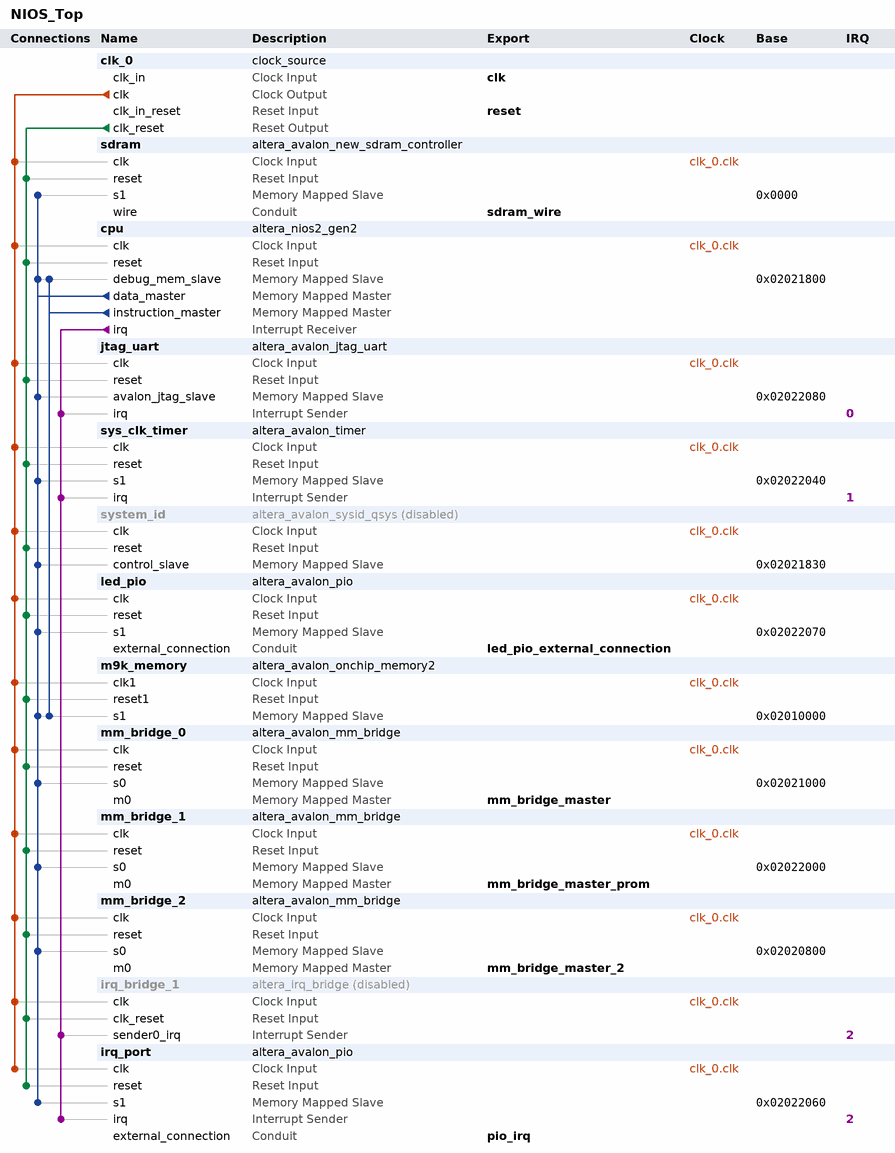
[diagram p0: system contents]
# Platform Designer (Qsys) system NIOS_Top, Cyclone IV E EP4CE22F17C6
# Parameters at their usual value, and those the tool derives, are not listed.
package require -exact qsys 15.0
create_system NIOS_Top
set_project_property DEVICE_FAMILY {Cyclone IV E}
set_project_property DEVICE EP4CE22F17C6

add_instance clk_0 clock_source 15.0
set_instance_parameter_value clk_0 clockFrequency 50000000

add_instance sdram altera_avalon_new_sdram_controller 15.0
set_instance_parameter_value sdram TAC 6.5
set_instance_parameter_value sdram TRCD 20.0
set_instance_parameter_value sdram TRP 20.0
set_instance_parameter_value sdram casLatency 2
set_instance_parameter_value sdram columnWidth 9
set_instance_parameter_value sdram dataWidth 16
set_instance_parameter_value sdram generateSimulationModel false
set_instance_parameter_value sdram initRefreshCommands 8
set_instance_parameter_value sdram model single_Micron_MT48LC4M32B2_7_chip
set_instance_parameter_value sdram numberOfBanks 4
set_instance_parameter_value sdram numberOfChipSelects 1
set_instance_parameter_value sdram powerUpDelay 200.0
set_instance_parameter_value sdram refreshPeriod 0.75
set_instance_parameter_value sdram rowWidth 13

add_instance cpu altera_nios2_gen2 15.0
set_instance_parameter_value cpu dcache_size 0
set_instance_parameter_value cpu exceptionSlave m9k_memory.s1
set_instance_parameter_value cpu icache_size 2048
set_instance_parameter_value cpu impl Tiny
set_instance_parameter_value cpu resetSlave m9k_memory.s1
set_instance_parameter_value cpu setting_branchpredictiontype Static

add_instance jtag_uart altera_avalon_jtag_uart 15.0
set_instance_parameter_value jtag_uart simInteractiveOptions NO_INTERACTIVE_WINDOWS

add_instance sys_clk_timer altera_avalon_timer 15.0
set_instance_parameter_value sys_clk_timer period 1
set_instance_parameter_value sys_clk_timer periodUnits MSEC

add_instance system_id altera_avalon_sysid_qsys 15.0
set_instance_property system_id ENABLED false
set_instance_parameter_value system_id id 2058710259

add_instance led_pio altera_avalon_pio 15.0
set_instance_parameter_value led_pio direction Output
set_instance_parameter_value led_pio width 8

add_instance m9k_memory altera_avalon_onchip_memory2 15.0
set_instance_parameter_value m9k_memory dataWidth 32
set_instance_parameter_value m9k_memory dualPort false
set_instance_parameter_value m9k_memory initMemContent true
set_instance_parameter_value m9k_memory initializationFileName onchip_mem.hex
set_instance_parameter_value m9k_memory memorySize 40000

add_instance mm_bridge_0 altera_avalon_mm_bridge 15.0
set_instance_parameter_value mm_bridge_0 ADDRESS_UNITS WORDS
set_instance_parameter_value mm_bridge_0 ADDRESS_WIDTH 9
set_instance_parameter_value mm_bridge_0 DATA_WIDTH 32
set_instance_parameter_value mm_bridge_0 MAX_PENDING_RESPONSES 4
set_instance_parameter_value mm_bridge_0 USE_AUTO_ADDRESS_WIDTH 0

add_instance mm_bridge_1 altera_avalon_mm_bridge 15.0
set_instance_parameter_value mm_bridge_1 ADDRESS_UNITS WORDS
set_instance_parameter_value mm_bridge_1 ADDRESS_WIDTH 4
set_instance_parameter_value mm_bridge_1 DATA_WIDTH 32
set_instance_parameter_value mm_bridge_1 MAX_PENDING_RESPONSES 4
set_instance_parameter_value mm_bridge_1 USE_AUTO_ADDRESS_WIDTH 0

add_instance mm_bridge_2 altera_avalon_mm_bridge 15.0
set_instance_parameter_value mm_bridge_2 ADDRESS_UNITS WORDS
set_instance_parameter_value mm_bridge_2 ADDRESS_WIDTH 9
set_instance_parameter_value mm_bridge_2 DATA_WIDTH 32
set_instance_parameter_value mm_bridge_2 MAX_PENDING_RESPONSES 4
set_instance_parameter_value mm_bridge_2 USE_AUTO_ADDRESS_WIDTH 0

add_instance irq_bridge_1 altera_irq_bridge 15.0
set_instance_property irq_bridge_1 ENABLED false
set_instance_parameter_value irq_bridge_1 IRQ_WIDTH 1

add_instance irq_port altera_avalon_pio 15.0
set_instance_parameter_value irq_port direction Input
set_instance_parameter_value irq_port generateIRQ true
set_instance_parameter_value irq_port width 1

# connections
add_connection clk_0.clk cpu.clk clock
add_connection clk_0.clk irq_bridge_1.clk clock
add_connection clk_0.clk irq_port.clk clock
add_connection clk_0.clk jtag_uart.clk clock
add_connection clk_0.clk led_pio.clk clock
add_connection clk_0.clk m9k_memory.clk1 clock
add_connection clk_0.clk mm_bridge_0.clk clock
add_connection clk_0.clk mm_bridge_1.clk clock
add_connection clk_0.clk mm_bridge_2.clk clock
add_connection clk_0.clk sdram.clk clock
add_connection clk_0.clk sys_clk_timer.clk clock
add_connection clk_0.clk system_id.clk clock
add_connection clk_0.clk_reset cpu.reset reset
add_connection clk_0.clk_reset irq_bridge_1.clk_reset reset
add_connection clk_0.clk_reset irq_port.reset reset
add_connection clk_0.clk_reset jtag_uart.reset reset
add_connection clk_0.clk_reset led_pio.reset reset
add_connection clk_0.clk_reset m9k_memory.reset1 reset
add_connection clk_0.clk_reset mm_bridge_0.reset reset
add_connection clk_0.clk_reset mm_bridge_1.reset reset
add_connection clk_0.clk_reset mm_bridge_2.reset reset
add_connection clk_0.clk_reset sdram.reset reset
add_connection clk_0.clk_reset sys_clk_timer.reset reset
add_connection clk_0.clk_reset system_id.reset reset
add_connection cpu.data_master cpu.debug_mem_slave avalon
set_connection_parameter_value cpu.data_master/cpu.debug_mem_slave baseAddress 0x02021800
add_connection cpu.data_master irq_port.s1 avalon
set_connection_parameter_value cpu.data_master/irq_port.s1 baseAddress 0x02022060
add_connection cpu.data_master jtag_uart.avalon_jtag_slave avalon
set_connection_parameter_value cpu.data_master/jtag_uart.avalon_jtag_slave baseAddress 0x02022080
add_connection cpu.data_master led_pio.s1 avalon
set_connection_parameter_value cpu.data_master/led_pio.s1 baseAddress 0x02022070
add_connection cpu.data_master m9k_memory.s1 avalon
set_connection_parameter_value cpu.data_master/m9k_memory.s1 baseAddress 0x02010000
add_connection cpu.data_master mm_bridge_0.s0 avalon
set_connection_parameter_value cpu.data_master/mm_bridge_0.s0 baseAddress 0x02021000
add_connection cpu.data_master mm_bridge_1.s0 avalon
set_connection_parameter_value cpu.data_master/mm_bridge_1.s0 baseAddress 0x02022000
add_connection cpu.data_master mm_bridge_2.s0 avalon
set_connection_parameter_value cpu.data_master/mm_bridge_2.s0 baseAddress 0x02020800
add_connection cpu.data_master sdram.s1 avalon
set_connection_parameter_value cpu.data_master/sdram.s1 baseAddress 0x0000
add_connection cpu.data_master sys_clk_timer.s1 avalon
set_connection_parameter_value cpu.data_master/sys_clk_timer.s1 baseAddress 0x02022040
add_connection cpu.data_master system_id.control_slave avalon
set_connection_parameter_value cpu.data_master/system_id.control_slave baseAddress 0x02021830
add_connection cpu.instruction_master cpu.debug_mem_slave avalon
set_connection_parameter_value cpu.instruction_master/cpu.debug_mem_slave baseAddress 0x02021800
add_connection cpu.instruction_master m9k_memory.s1 avalon
set_connection_parameter_value cpu.instruction_master/m9k_memory.s1 baseAddress 0x02010000
add_connection cpu.irq irq_bridge_1.sender0_irq interrupt
set_connection_parameter_value cpu.irq/irq_bridge_1.sender0_irq irqNumber 2
add_connection cpu.irq irq_port.irq interrupt
set_connection_parameter_value cpu.irq/irq_port.irq irqNumber 2
add_connection cpu.irq jtag_uart.irq interrupt
set_connection_parameter_value cpu.irq/jtag_uart.irq irqNumber 0
add_connection cpu.irq sys_clk_timer.irq interrupt
set_connection_parameter_value cpu.irq/sys_clk_timer.irq irqNumber 1

# exported interfaces
add_interface clk clock sink
set_interface_property clk EXPORT_OF clk_0.clk_in
add_interface led_pio_external_connection conduit end
set_interface_property led_pio_external_connection EXPORT_OF led_pio.external_connection
add_interface mm_bridge_master avalon master
set_interface_property mm_bridge_master EXPORT_OF mm_bridge_0.m0
add_interface mm_bridge_master_2 avalon master
set_interface_property mm_bridge_master_2 EXPORT_OF mm_bridge_2.m0
add_interface mm_bridge_master_prom avalon master
set_interface_property mm_bridge_master_prom EXPORT_OF mm_bridge_1.m0
add_interface pio_irq conduit end
set_interface_property pio_irq EXPORT_OF irq_port.external_connection
add_interface reset reset sink
set_interface_property reset EXPORT_OF clk_0.clk_in_reset
add_interface sdram_wire conduit end
set_interface_property sdram_wire EXPORT_OF sdram.wire

set_interconnect_requirement {$system} qsys_mm.clockCrossingAdapter HANDSHAKE
set_interconnect_requirement {$system} qsys_mm.enableEccProtection FALSE
set_interconnect_requirement {$system} qsys_mm.insertDefaultSlave FALSE
set_interconnect_requirement {$system} qsys_mm.maxAdditionalLatency 1

save_system NIOS_Top.qsys
